# Altium schematic sheet MF72-10D7 NTC thermistor.schdoc
size 127 x 101 mm
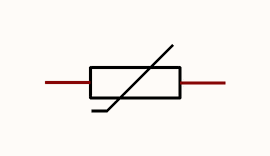
[diagram p0: MF72-10D7 NTC thermistor.schdoc]

## Parts
R?  MF72 10D7_C72680  [RES-TH_L6.5-W5.0-P5.00-D0.6-S4.40]  (value not drawn)

## Nets

Not connected (* = marked no-connect by the designer): R? 1 2

## Library data of the parts
R? = MF72 10D7_C72680: Manufacturer: 时恒; Symbol: MF72-10D7; Value: Power; Add into BOM: yes; Steady State Current (Max): 1A; Device: MF72 10D7_C72680; Supplier: LCSC; Manufacturer Part: MF72 10D7; Supplier Part: C72680; JLCPCB Part Class: Extended Part; LCSC Part Name: 10Ω 电阻精度:±20% 2800K; Supplier Footprint: 插件,P=5mm; Datasheet: https://atta.szlcsc.com/upload/public/pdf/source/20231113/55BE817FC059D652AE7104DE5FB0A908.pdf; Convert to PCB: yes; B Constant (25℃/75℃): -; B Constant (25℃/85℃): -; B Constant (25℃/100℃): -; Operating Temperature: -40℃~+130℃